# EAGLE design IGauge+V.2.3 (EAGLE 7.5.0)
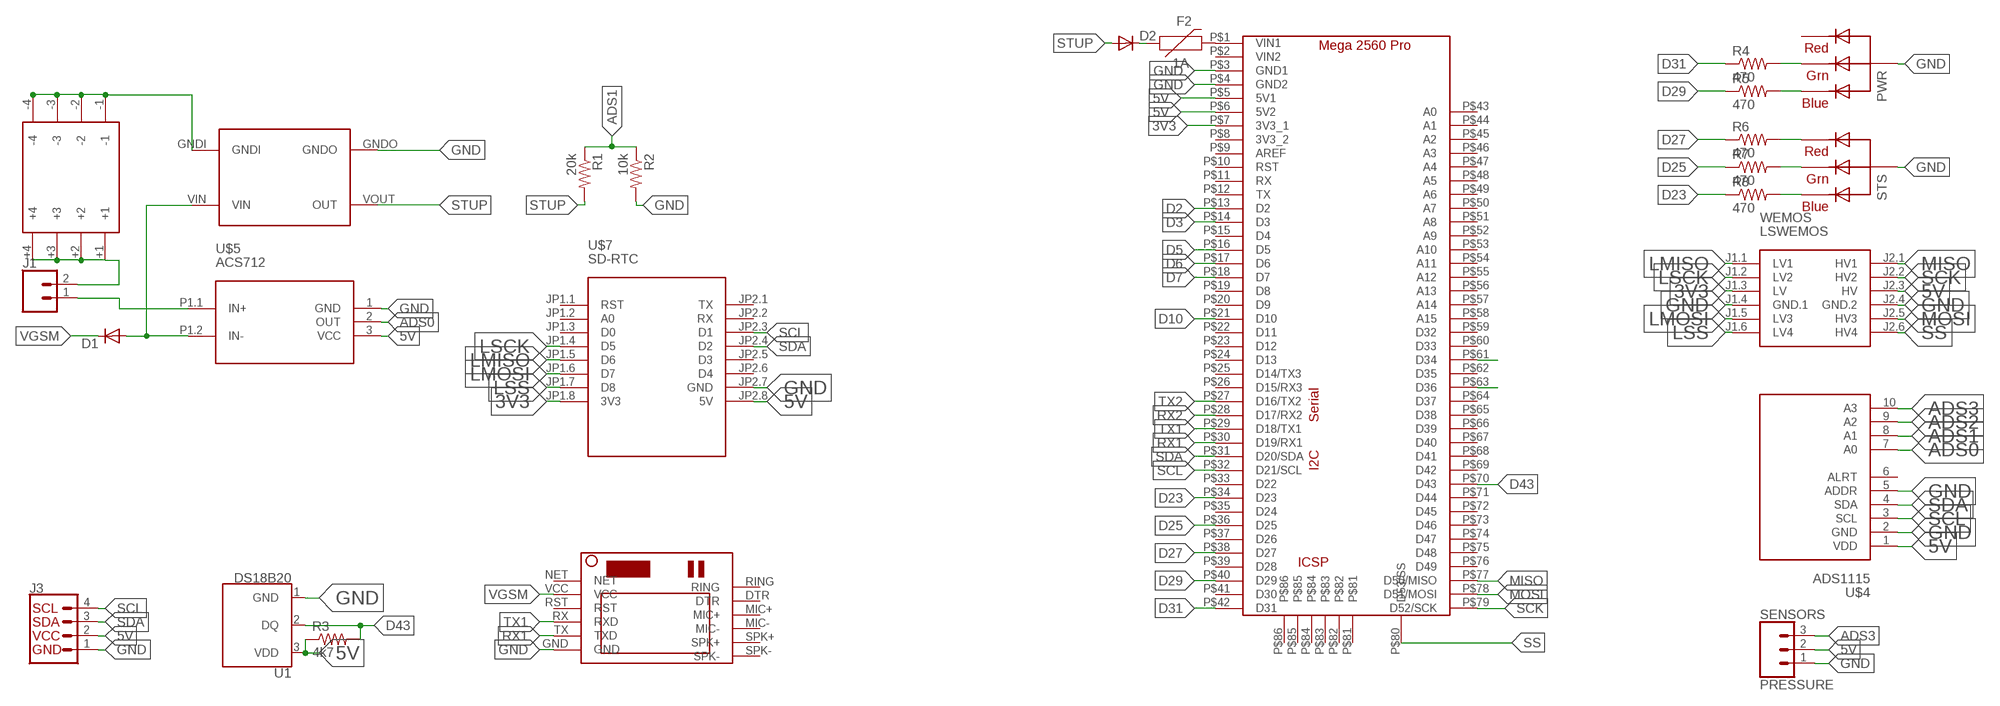
[diagram p0: schematic, sheet 1]

## Parts
D1  DIODE-SOD106A-R  [SOD106A-R]
D2  DIODE-SOD106A-R  [SOD106A-R]
F2  1A  PPTC_HALF-AMP  [1206]
J1  CONN_02  [1X02]
J3  I2C_STANDARD  [1X04]
PWR  RGBLED_CA-5MM  [LED5MMRGB]
R1  20k  R-US_R1206  [R1206]
R2  10k  R-US_R1206  [R1206]
R3  4k7  R-US_M1406  [M1406]
R4  470  R-US_R1206  [R1206]
R5  470  R-US_R1206  [R1206]
R6  470  R-US_R1206  [R1206]
R7  470  R-US_R1206  [R1206]
R8  470  R-US_R1206  [R1206]
SENSORS  PRESSURE  CONN_03POLAR  [MOLEX-1X3]
STS  RGBLED_CA-5MM  [LED5MMRGB]
U1  DS18B20  [TO-92-AMMO]
U$2  MT360_STEPUP  [MT360_STEPUP]
U$3  MEGAPROMINI  [MEGAPROMINI]
U$4  ADS1115  ADC-4CH-ADS1115  [ADC-4CH-ADS1115]
U$5  ACS712  CURRENT-SENSOR-ACS712#IC  [CURRENT-SENSOR-ACS712#IC]
U$7  SD-RTC  WEMOS-D1-MINI-SHIELD  [WEMOS-D1-MINI-SHIELD]
U$9  18650_4PCS_BATTERY_HOLDER  [18650_4PCS_BATTERY_HOLDER]
U$10  SIM800LMODULE  [SIM800LMODULE]
WEMOS  LSWEMOS  LEVEL-SHIFTER-4CH  [LEVEL-SHIFTER-4CH]

## Nets
3V3: U$3.P$7(3V3_1) U$7.JP1.8(3V3) WEMOS.J1.3(LV)
5V: J3.2 R3.1 SENSORS.2 U1.3(VDD) U$3.P$5(5V1) U$3.P$6(5V2) U$4.1(VDD) U$5.3(VCC) U$7.JP2.8(5V) WEMOS.J2.3(HV)
ADS0: U$4.7(A0) U$5.2(OUT)
ADS1: R1.1 R2.1 U$4.8(A1)
ADS2: U$4.9(A2)
ADS3: SENSORS.3 U$4.10(A3)
D2: U$3.P$13(D2)
D3: U$3.P$14(D3)
D5: U$3.P$16(D5)
D6: U$3.P$17(D6)
D7: U$3.P$18(D7)
D10: U$3.P$21(D10)
D23: R8.1 U$3.P$34(D23)
D25: R7.1 U$3.P$36(D25)
D27: R6.1 U$3.P$38(D27)
D29: R5.1 U$3.P$40(D29)
D31: R4.1 U$3.P$42(D31)
D34: U$3.P$61(D34)
D36: U$3.P$63(D36)
D43: R3.2 U1.2(DQ) U$3.P$70(D43)
GND: J3.1 PWR.2(VCC) R2.2 SENSORS.1 STS.2(VCC) U1.1(GND) U$2.GNDO U$3.P$3(GND1) U$3.P$4(GND2) U$4.2(GND) U$4.5(ADDR) U$5.1(GND) U$7.JP2.7(GND) U$10.GND WEMOS.J1.4(GND.1) WEMOS.J2.4(GND.2)
LMISO: U$7.JP1.5(D6) WEMOS.J1.1(LV1)
LMOSI: U$7.JP1.6(D7) WEMOS.J1.5(LV3)
LSCK: U$7.JP1.4(D5) WEMOS.J1.2(LV2)
LSS: U$7.JP1.7(D8) WEMOS.J1.6(LV4)
MISO: U$3.P$77(D50/MISO) WEMOS.J2.1(HV1)
MOSI: U$3.P$78(D51/MOSI) WEMOS.J2.5(HV3)
N$3: J1.1 U$5.P1.1(IN+)
N$4: PWR.3(GREEN) R4.2
N$5: F2.2 U$3.P$1(VIN1)
N$6: D2.C F2.1
N$7: U$2.GNDI U$9.-1 U$9.-4
N$9: U$9.-2
N$12: PWR.4(BLUE) R5.2
N$13: R6.2 STS.1(RED)
N$14: U$9.-3
N$19: R7.2 STS.3(GREEN)
N$20: R8.2 STS.4(BLUE)
RX1: U$3.P$30(D19/RX1) U$10.TX(TXD)
RX2: U$3.P$28(D17/RX2)
SCK: U$3.P$79(D52/SCK) WEMOS.J2.2(HV2)
SCL: J3.4 U$3.P$32(D21/SCL) U$4.3(SCL) U$7.JP2.3(D1)
SDA: J3.3 U$3.P$31(D20/SDA) U$4.4(SDA) U$7.JP2.4(D2)
SS: U$3.P$80(D53/SS) WEMOS.J2.6(HV4)
STUP: D2.A R1.2 U$2.VOUT(OUT)
TX1: U$3.P$29(D18/TX1) U$10.RX(RXD)
TX2: U$3.P$27(D16/TX2)
VACS: D1.A U$2.VIN U$5.P1.2(IN-)
VGSM: D1.C U$10.VCC
VIN: J1.2 U$9.+1 U$9.+2 U$9.+3 U$9.+4
Unconnected: PWR.1(RED) U$3.P$2(VIN2) U$3.P$8(3V3_2) U$3.P$9(AREF) U$3.P$10(RST) U$3.P$11(RX) U$3.P$12(TX) U$3.P$15(D4) U$3.P$19(D8) U$3.P$20(D9) U$3.P$22(D11) U$3.P$23(D12) U$3.P$24(D13) U$3.P$25(D14/TX3) U$3.P$26(D15/RX3) U$3.P$33(D22) U$3.P$35(D24) U$3.P$37(D26) U$3.P$39(D28) U$3.P$41(D30) U$3.P$43(A0) U$3.P$44(A1) U$3.P$45(A2) U$3.P$46(A3) U$3.P$47(A4) U$3.P$48(A5) U$3.P$49(A6) U$3.P$50(A7) U$3.P$51(A8) U$3.P$52(A9) U$3.P$53(A10) U$3.P$54(A11) U$3.P$55(A12) U$3.P$56(A13) U$3.P$57(A14) U$3.P$58(A15) U$3.P$59(D32) U$3.P$60(D33) U$3.P$62(D35) U$3.P$64(D37) U$3.P$65(D38) U$3.P$66(D39) U$3.P$67(D40) U$3.P$68(D41) U$3.P$69(D42) U$3.P$71(D44) U$3.P$72(D45) U$3.P$73(D46) U$3.P$74(D47) U$3.P$75(D48) U$3.P$76(D49) U$3.P$81 U$3.P$82 U$3.P$83 U$3.P$84 U$3.P$85 U$3.P$86 U$4.6(ALRT) U$7.JP1.1(RST) U$7.JP1.2(A0) U$7.JP1.3(D0) U$7.JP2.1(TX) U$7.JP2.2(RX) U$7.JP2.5(D3) U$7.JP2.6(D4) U$10.DTR U$10.MIC+ U$10.MIC- U$10.NET U$10.RING U$10.RST U$10.SPK+ U$10.SPK-

## Library data of the parts
D1 D2 = diode:DIODE-: DIODE
F2 = SparkFun-Fuses:PPTC: Resettable Fuse PPTC Resettable Fuse. Really a sort of resistor with a polymeric positive temperature coefficient whose resistance increases dramatically with an increase in temperature. When heated by the power passing through the resistance rises causing the current to be limited, protecting the circuit. This is achieved by the transition of the polymer from a crystalline to an amorphous state where the conductive carbon separates breaking the conductive pathways found in the cool crystalline structure. When a PPTC cools back down it resumes conducting letting the circuit turn back on. SparkFun Products: SparkFun RedBoard - Programmed with Arduino <https://www.sparkfun.com/products/12757> Pro Micro - 5V/16MHz <https://www.sparkfun.com/products/12640> Arduino Pro 328 - 5V/16MHz <https://www.sparkfun.com/products/10915> MP3 Trigger <https://www.sparkfun.com/products/13720>; PROD_ID: RES-08585; VALUE: 6V/0.5A
J1 = SparkFun-Connectors:CONN_02: Multi connection point. Often used as Generic Header-pin footprint for 0.1 inch spaced/style header connections On any of the 0.1 inch spaced packages, you can populate with these: Break Away Headers - Straight <https://www.sparkfun.com/products/116> (PRT-00116) Break Away Male Headers - Right Angle <https://www.sparkfun.com/products/553> (PRT-00553) Female Headers <https://www.sparkfun.com/products/115> (PRT-00115) Break Away Headers - Machine Pin <https://www.sparkfun.com/products/117> (PRT-00117) Break Away Female Headers - Swiss Machine Pin <https://www.sparkfun.com/products/743> (PRT-00743) For SCREWTERMINALS and SPRING TERMINALS visit here: Screw Terimnals on SparkFun.com <https://www.sparkfun.com/search/results?term=Screw+Terminals> (5mm/3.5mm/2.54mm spacing) This device is also useful as a general connection point to wire up your design to another part of your project. Our various solder wires solder well into these plated through hole pads. Hook-Up Wire - Assortment (Stranded, 22 AWG) <https://www.sparkfun.com/products/11375> (PRT-11375) Hook-Up Wire - Assortment (Solid Core, 22 AWG) <https://www.sparkfun.com/products/11367> (PRT-11367) View the entire wire category on our website here <https://www.sparkfun.com/categories/141> Special notes: Molex polarized connector foot print use with: PRT-08233 with associated crimp pins and housings. 2.54_SCREWTERM for use with PRT-10571. 3.5mm Screw Terminal footprints for PRT-08084 5mm Screw Terminal footprints for use with PRT-08432
J3 = SparkFun-Connectors:I2C_STANDARD: SparkFun I2C Standard Pinout Header SparkFun has standardized on a pinout for all I2C based sensor breakouts. This pinout allows I2C boards to be plugged directly into the headers on Arduino Uno compatible boards, and to be daisy chained easily. Example SparkFun Products: SparkFun Atmospheric Sensor Breakout - BME280 <https://www.sparkfun.com/products/13676> SparkFun Altitude/Pressure Sensor Breakout - MPL3115A2 <https://www.sparkfun.com/products/11084> SparkFun TOF Range Finder Sensor - VL6180 <https://www.sparkfun.com/products/12785>
PWR STS = adafruit:RGBLED_CA: RGB LED, common-anode 5MM Staggered pins 5mm Piranha package http://www.ladyada.net/library/pcb/eaglelibrary.html
R1 R2 R4-R8 = resistor:R-US_: RESISTOR, American symbol
R3 = adafruit:R-US_: RESISTOR, American symbol
SENSORS = SparkFun-Connectors:CONN_03: Multi connection point. Often used as Generic Header-pin footprint for 0.1 inch spaced/style header connections On any of the 0.1 inch spaced packages, you can populate with these: Break Away Headers - Straight <https://www.sparkfun.com/products/116> (PRT-00116) Break Away Male Headers - Right Angle <https://www.sparkfun.com/products/553> (PRT-00553) Female Headers <https://www.sparkfun.com/products/115> (PRT-00115) Break Away Headers - Machine Pin <https://www.sparkfun.com/products/117> (PRT-00117) Break Away Female Headers - Swiss Machine Pin <https://www.sparkfun.com/products/743> (PRT-00743) Stackable Header - 3 Pin (Female, 0.1") <https://www.sparkfun.com/products/13875> (PRT-13875) For SCREWTERMINALS and SPRING TERMINALS visit here: Screw Terimnals on SparkFun.com <https://www.sparkfun.com/search/results?term=Screw+Terminals> (5mm/3.5mm/2.54mm spacing) This device is also useful as a general connection point to wire up your design to another part of your project. Our various solder wires solder well into these plated through hole pads. Hook-Up Wire - Assortment (Stranded, 22 AWG) <https://www.sparkfun.com/products/11375> (PRT-11375) Hook-Up Wire - Assortment (Solid Core, 22 AWG) <https://www.sparkfun.com/products/11367> (PRT-11367) View the entire wire category on our website here <https://www.sparkfun.com/categories/141> Special notes: Molex polarized connector foot print use with SKU : PRT-08232 with associated crimp pins and housings.; PROD_ID: CONN-08625; SF_ID: PRT-08096
U1 = SparkFun-Sensors:DS18B20: Dallas/Maxim DS18B20 1-Wire Temperature Sensor The DS18B20 reports degrees C with 9 to 12-bit precision, -55C to 125C (+/-0.5C). Each sensor has a unique 64-Bit Serial number etched into it - allows for a huge number of sensors to be used on one data bus. Datasheet <http://datasheets.maximintegrated.com/en/ds/DS18B20.pdf> SparkFun Products One Wire Digital Temperature Sensor - DS18B20 <https://www.sparkfun.com/products/245> (SEN-00245); STORE_ID: SEN-00245
U$2 = MT360_STEPUP:MT360_STEPUP
U$3 = MEGAPROMINI:MEGAPROMINI
U$4 = diy-modules:ADC-4CH-ADS1115: 4 Channel 16-Bit Analog-to-Digital Converter based on ADS1115 chip Arduino ADS1115 Getting Started Tutorial is available here: http://henrysbench.capnfatz.com/henrys-bench/arduino-voltage-measurements/arduino-ads1115-module-getting-started-tutorial/ ADS1115 datasheet is available here: http://www.ti.com/lit/ds/symlink/ads1115.pdf Click here to find device on ebay.com <http://www.ebay.com/sch/ads1115+module>
U$5 = diy-modules:CURRENT-SENSOR-ACS712#IC: Isolated Bipolar Current Sensors based on ACS712 chip Symbol with input pins More details available here: http://embedded-lab.com/blog/a-brief-overview-of-allegro-acs712-current-sensor-part-1/ Click here to find device on ebay.com <http://www.ebay.com/sch/acs712+module> Note: There are many available versions with different pinout. Please check before use
U$7 = diy-modules:WEMOS-D1-MINI-SHIELD: Template for WEMOS D1 mini compatible shields NOTICE: This is a template only. You can use it as a base to create symbols for WEMOS D1 mini compatible shields. Official list of available shields can be found here: https://www.wemos.cc/D1-mini-Shields
U$9 = 18650-Battery-Holder:18650_4PCS_BATTERY_HOLDER
U$10 = SIM800LMODULE:SIM800LMODULE: SIM800L Module
WEMOS = diy-modules:LEVEL-SHIFTER-4CH: 4-Channel Bi-Directional Logic Level Converter based on BSS128 transistors Click here to find device on ebay.com <http://www.ebay.com/sch/i2c+logic+converter+module>

## Board
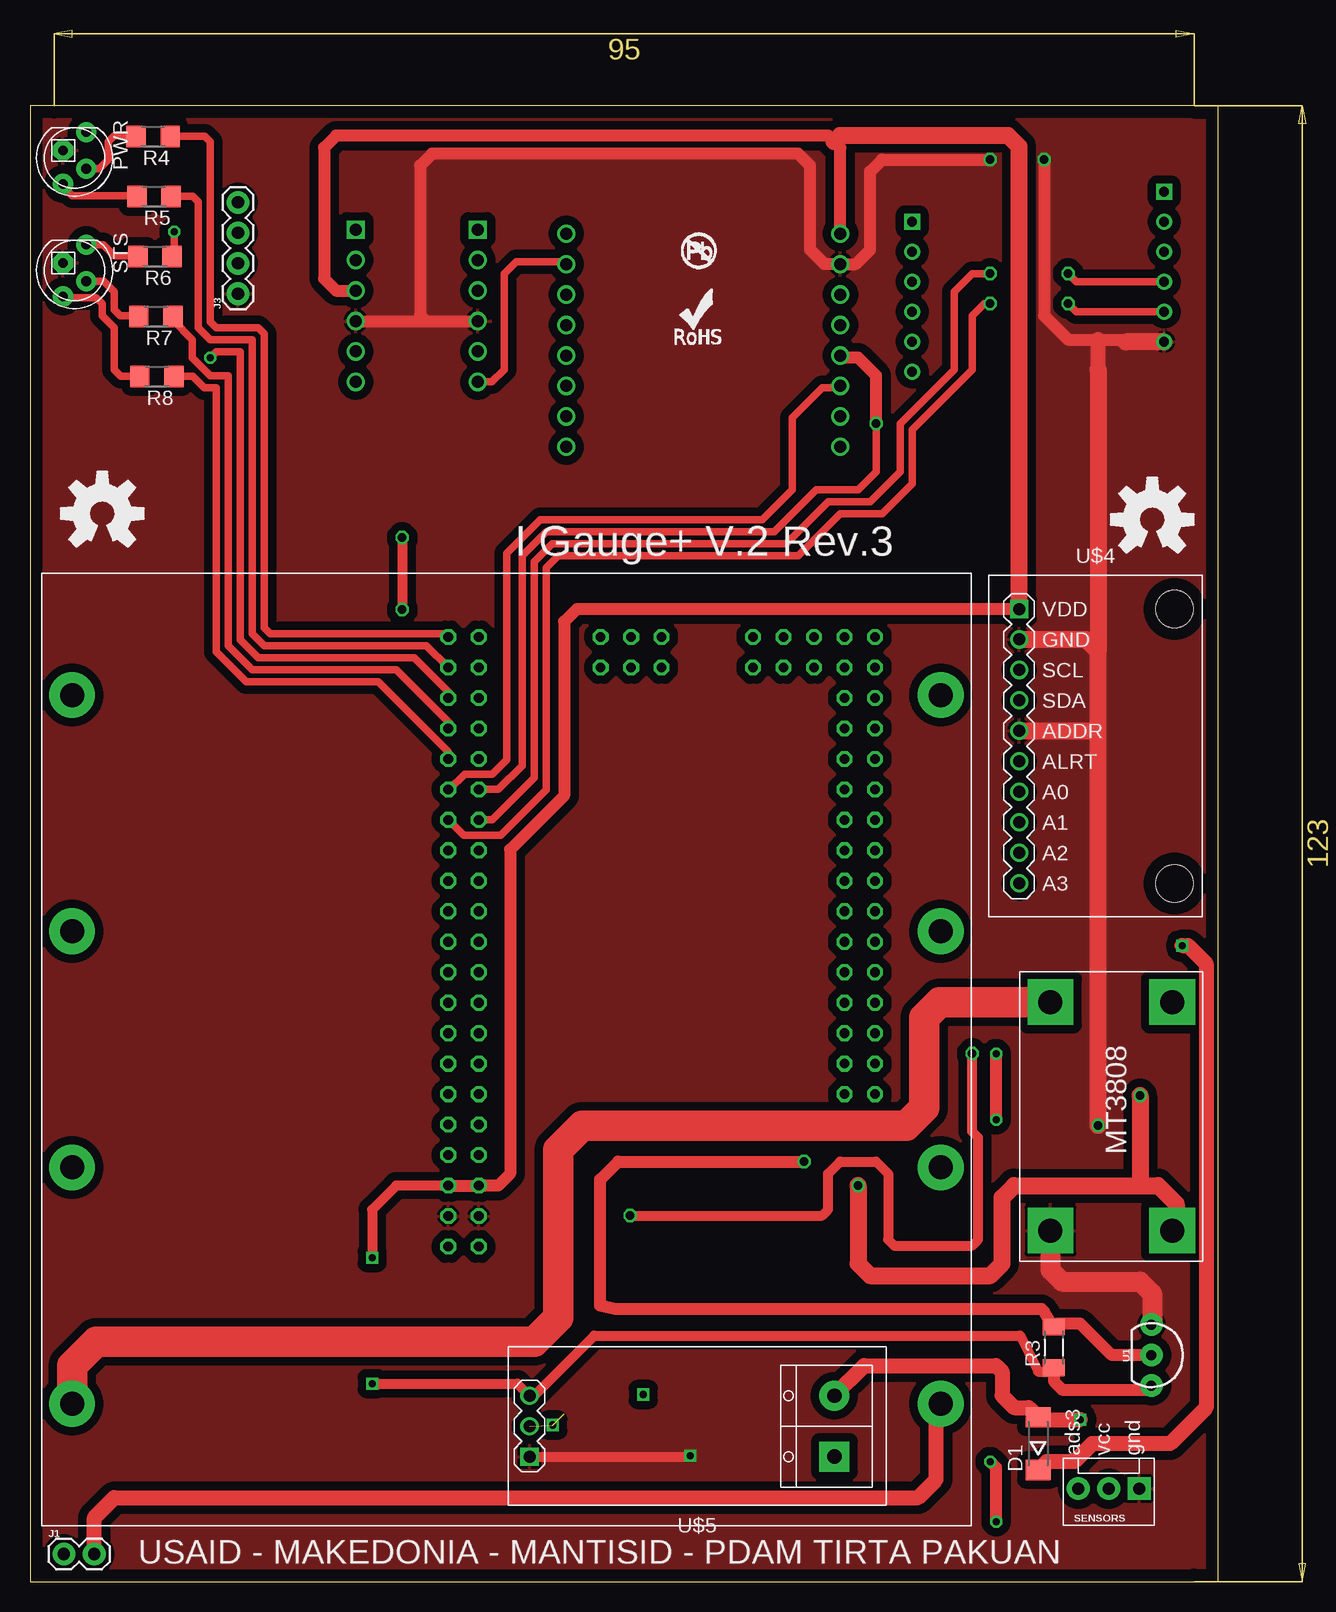
[diagram p1: board, top side]
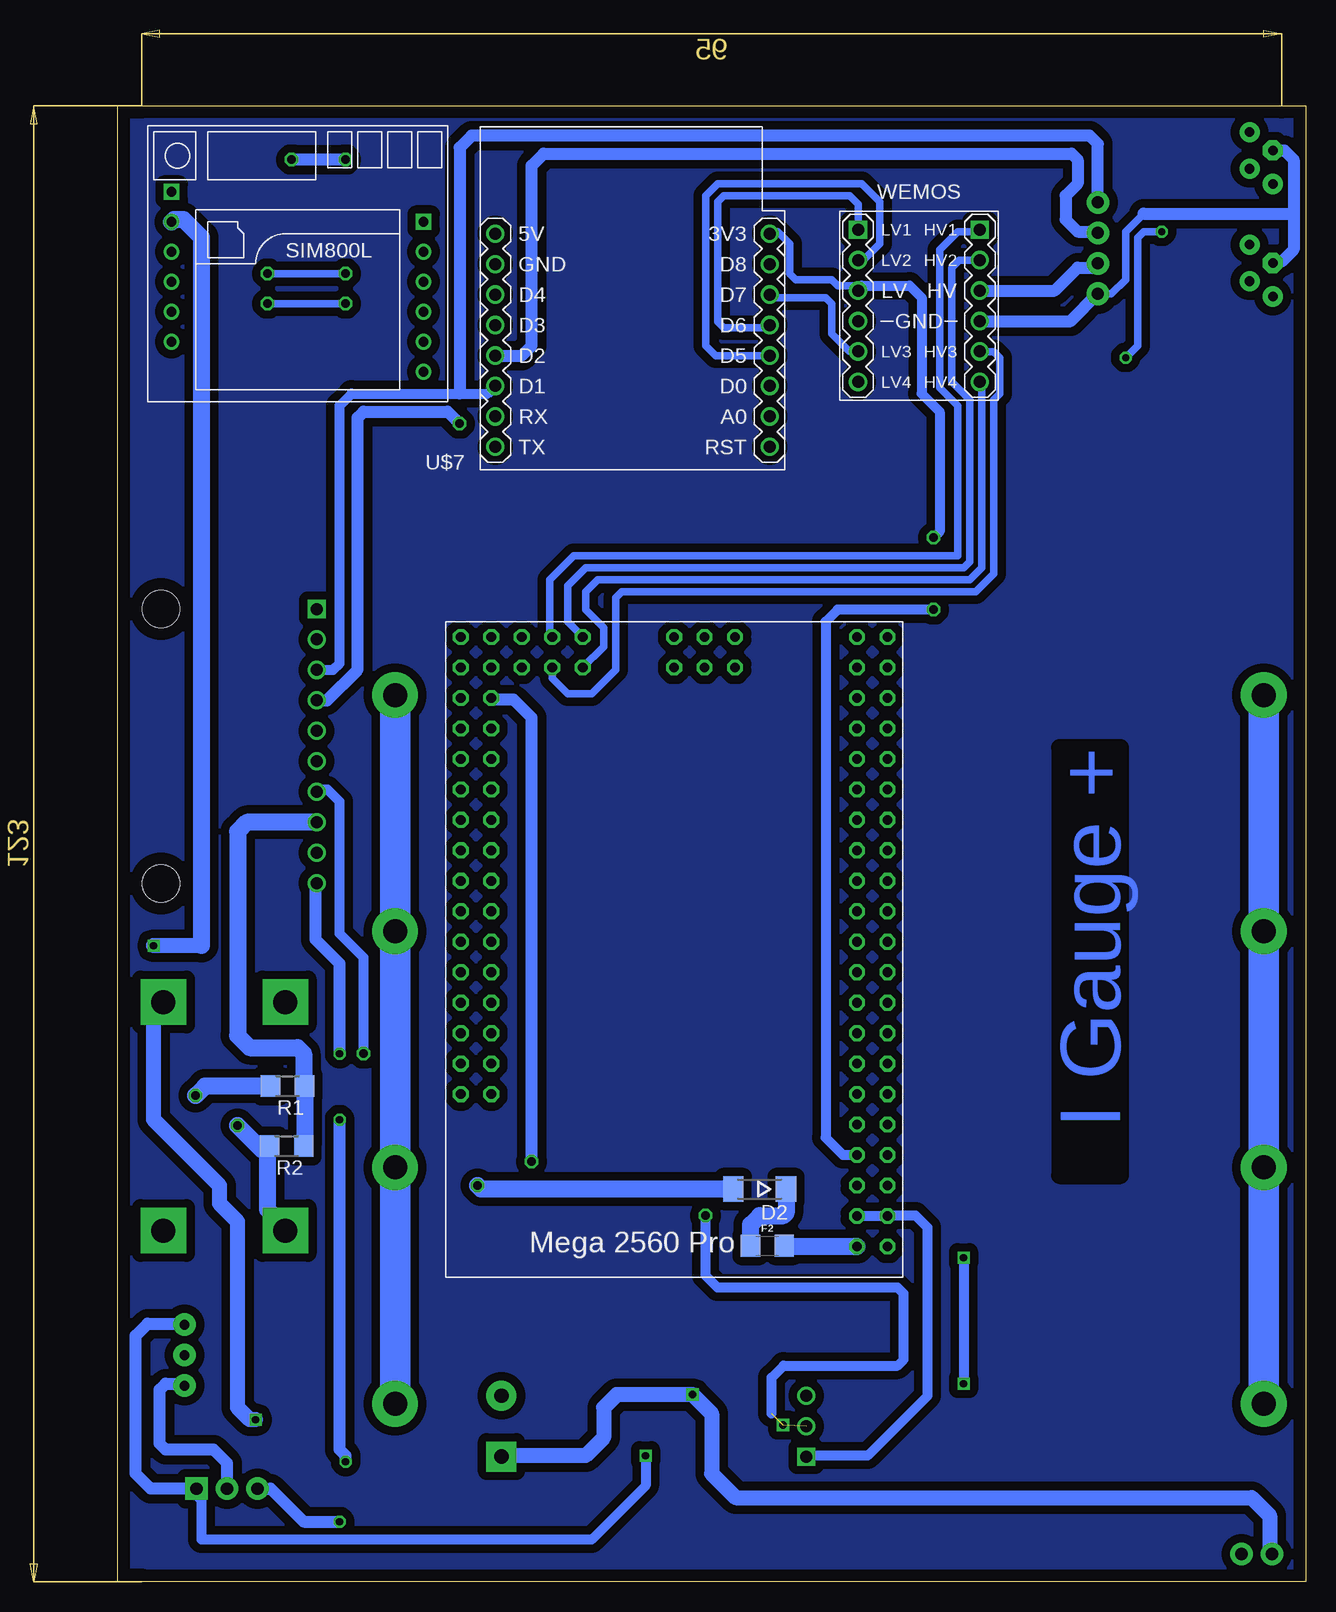
[diagram p2: board, bottom side, seen from below]

Size 99 x 123 mm. Coordinates in mm from the lower left corner, seen from the top.
Outline: 0,123 0,0 99,0 99,123 0,123
Copper layers (1*16): Top 0.035mm / dielectric 1.5mm / Bottom 0.035mm
Design rules "default *": minimum track width 10mil, minimum drill 24mil, track to track 28mil, track to pad 28mil, pad to pad 28mil, via to via 28mil, smd to smd 28mil, copper to edge 40mil, drill to drill 8mil, minimum pad ring 10mil, minimum via ring 8mil, stop-mask expansion 4mil, vias tented up to drill 0mil, thermal gap 10mil

### Footprints (pad centres in the part's own frame; a part is rotated, then mirrored left to right if it is on the bottom)
SOD106A-R = smd 1.7 x 2.1: A 2.2,0; C -2.2,0
1206 = smd 1.6 x 1.8: 1 -1.4,0; 2 1.4,0
1X02 = drill 1.016 pad 1.88: 1 0,0; 2 2.54,0
1X04 = drill 1.016 pad 1.88: 1 0,0; 2 2.54,0; 3 5.08,0; 4 7.62,0
LED5MMRGB = drill 0.8 pad 1.676: 1 -2.159,0.968; 3 0.889,0.968; 4 2.159,-0.968 | drill 0.8 pad 1.676 octagon: 2 -0.635,-0.968
R1206 = smd 1.6 x 1.803: 1 -1.422,0; 2 1.422,0
M1406 = smd 1.4 x 1.8: 1 -1.7,0; 2 1.7,0
MOLEX-1X3 = drill 1.016 pad 1.88 square: 1 0,0 | drill 1.016 pad 1.88: 2 2.54,0; 3 5.08,0
TO-92-AMMO = drill 0.813 pad 1.88: 1 -2.54,0; 2 0,0; 3 2.54,0
MT360_STEPUP = drill 2 pad 3.81 square: GNDI 3.81,-2.54; GNDO 3.81,-21.59; VIN 13.97,-2.54; VOUT 13.97,-21.59
MEGAPROMINI = drill 0.8 octagon: P$1 3.81,-2.54; P$2 1.27,-2.54; P$3 3.81,-5.08; P$4 1.27,-5.08; P$5 3.81,-7.62; P$6 1.27,-7.62; P$7 3.81,-10.16; P$8 1.27,-10.16; P$9 3.81,-12.7; P$10 1.27,-12.7; P$11 3.81,-15.24; P$12 1.27,-15.24; P$13 3.81,-17.78; P$14 1.27,-17.78; P$15 3.81,-20.32; P$16 1.27,-20.32; P$17 3.81,-22.86; P$18 1.27,-22.86; P$19 3.81,-25.4; P$20 1.27,-25.4; P$21 3.81,-27.94; P$22 1.27,-27.94; P$23 3.81,-30.48; P$24 1.27,-30.48; P$25 3.81,-33.02; P$26 1.27,-33.02; P$27 3.81,-35.56; P$28 1.27,-35.56; P$29 3.81,-38.1; P$30 1.27,-38.1; P$31 3.81,-40.64; P$32 1.27,-40.64; P$33 3.81,-43.18; P$34 1.27,-43.18; P$35 3.81,-45.72; P$36 1.27,-45.72; P$37 3.81,-48.26; P$38 1.27,-48.26; P$39 3.81,-50.8; P$40 1.27,-50.8; P$41 3.81,-53.34; P$42 1.27,-53.34; P$43 36.83,-15.24; P$44 34.29,-15.24; P$45 36.83,-17.78; P$46 34.29,-17.78; P$47 36.83,-20.32; P$48 34.29,-20.32; P$49 36.83,-22.86; P$50 34.29,-22.86; P$51 36.83,-25.4; P$52 34.29,-25.4; P$53 36.83,-27.94; P$54 34.29,-27.94; P$55 36.83,-30.48; P$56 34.29,-30.48; P$57 36.83,-33.02; P$58 34.29,-33.02; P$59 36.83,-35.56; P$60 34.29,-35.56; P$61 36.83,-38.1; P$62 34.29,-38.1; P$63 36.83,-40.64; P$64 34.29,-40.64; P$65 36.83,-43.18; P$66 34.29,-43.18; P$67 36.83,-45.72; P$68 34.29,-45.72; P$69 36.83,-48.26; P$70 34.29,-48.26; P$71 36.83,-50.8; P$72 34.29,-50.8; P$73 36.83,-53.34; P$74 34.29,-53.34; P$75 31.75,-53.34; P$76 31.75,-50.8; P$77 29.21,-53.34; P$78 29.21,-50.8; P$79 26.67,-53.34; P$80 26.67,-50.8; P$81 19.05,-53.34; P$82 19.05,-50.8; P$83 16.51,-53.34; P$84 16.51,-50.8; P$85 13.97,-53.34; P$86 13.97,-50.8
ADC-4CH-ADS1115 = drill 1 square: 1 -6.35,11.43 | drill 1: 2 -6.35,8.89; 3 -6.35,6.35; 4 -6.35,3.81; 5 -6.35,1.27; 6 -6.35,-1.27; 7 -6.35,-3.81; 8 -6.35,-6.35; 9 -6.35,-8.89; 10 -6.35,-11.43 | hole 3.1: 6.604,11.43; 6.604,-11.43
CURRENT-SENSOR-ACS712#IC = drill 1 square: 1 13.97,2.54 | drill 1: 2 13.97,0; 3 13.97,-2.54 | drill 1.2 pad 2.5 square: P1.1 -11.43,2.54 | drill 1.2 pad 2.5: P1.2 -11.43,-2.54
WEMOS-D1-MINI-SHIELD = drill 1: JP1.1 -11.43,12.065; JP1.2 -11.43,9.525; JP1.3 -11.43,6.985; JP1.4 -11.43,4.445; JP1.5 -11.43,1.905; JP1.6 -11.43,-0.635; JP1.7 -11.43,-3.175; JP1.8 -11.43,-5.715; JP2.1 11.43,12.065; JP2.2 11.43,9.525; JP2.3 11.43,6.985; JP2.4 11.43,4.445; JP2.5 11.43,1.905; JP2.6 11.43,-0.635; JP2.7 11.43,-3.175; JP2.8 11.43,-5.715
18650_4PCS_BATTERY_HOLDER = drill 2 pad 3.81: +1 10.16,74.93; +2 29.845,74.93; +3 49.53,74.93; +4 69.215,74.93; -1 10.16,2.54; -2 29.845,2.54; -3 49.53,2.54; -4 69.215,2.54
SIM800LMODULE = drill 0.8: DTR 10.5,1; GND -10.5,-6.5; MIC+ 10.5,-1.5; MIC- 10.5,-4; RST -10.5,1; RX -10.5,-1.5; SPK+ 10.5,-6.5; SPK- 10.5,-9; TX -10.5,-4; VCC -10.5,3.5 | drill 0.8 square: NET -10.5,6; RING 10.5,3.5
LEVEL-SHIFTER-4CH = drill 1 square: J1.1 -5.08,6.35; J2.1 5.08,6.35 | drill 1: J1.2 -5.08,3.81; J1.3 -5.08,1.27; J1.4 -5.08,-1.27; J1.5 -5.08,-3.81; J1.6 -5.08,-6.35; J2.2 5.08,3.81; J2.3 5.08,1.27; J2.4 5.08,-1.27; J2.5 5.08,-3.81; J2.6 5.08,-6.35

### Placement (x,y rotation side)
D1  84,11.5 90 top
D2  45.5,32.71 180 bottom
F2  44.85,27.99 0 bottom
J1  2.8,2.3 0 top
J3  17.31,107.32 90 top
PWR  3.7,118.63 270 top
R1  84.84,41.3 180 bottom
R2  84.92,36.3 180 bottom
R3  85.3,19.51 90 top
R4  10.24,120.44 180 top
R5  10.32,115.44 180 top
R6  10.4,110.44 180 top
R7  10.48,105.44 180 top
R8  10.56,100.44 180 top
SENSORS  92.42,7.74 180 top
STS  3.7,109.25 270 top
U1  93.43,18.87 270 top
U$1  [NO_PB_LOGO_0.120]  54,109 0 top
U$2  81.21,50.84 0 top
U$3  33.57,25.38 180 bottom
U$4  88.77,69.62 0 top
U$5  55.58,12.95 180 top
U$6  [OSHW-LOGO-L]  6,89 0 top
U$7  56.09,106.62 180 bottom
U$8  [OSHW-LOGO-L]  93.5,88.5 0 top
U$9  0.95,84.04 270 top
U$10  84,109.82 0 bottom
U$11  [ROHS_LOGO_0.18_IN]  53.5,103 0 top
WEMOS  32.22,106.32 0 bottom

### Tracks (layer width: path | path; a pad name or v marks a point on that pad's centre or on a via)
3V3  (via drill 0.7)
  Top 0.813: v31,87 v31,81
  Bottom 0.61: WEMOS.J1.3 37.71,108 39,108 39.5,108.5 42.5,108.5 43,109 43,111.5 44,112.5 44.49,112.5 U$7.JP1.8
  Bottom 0.813: U$3.P$7 38.54,35.54 39,36 39.5,36.5 40,37 40,80 39,81 v31,81 | WEMOS.J1.3 37.3,107.7 37,108 33,108 32,107 32,99 30.5,97.5 30.5,87.5 v31,87
5V  (via drill 0.6)
  Top 0.813: 39,33 30.5,33 28.5,31 v28.5,27 | v28.5,16.5 40.6,16.5 U$5.3 41.99,15.49 47,20.5 82.5,20.5 84,17.5 84.99,17.5 R3.1
  Top 1.016: U$7.JP2.8 67.52,119.48 67,120 66.5,120.5 25.5,120.5 24.5,119.5 24.5,108.59 25.5,107.59 WEMOS.J2.3 | R3.1 85.3,16.7 86,16 93.1,16 U1.3 | U$3.P$6 U$3.P$5 39,33 40,34 40,61 44.5,65.5 44.5,80 45.55,81.05 U$4.1
  Top 1.422: U$4.1 82.42,119.58 81.5,120.5 67.5,120.5 67,120
  Bottom 0.813: v28.5,27 v28.5,16.5
  Bottom 1.016: WEMOS.J2.3 20.91,107.59 19,109.5 17.67,109.5 J3.2 | SENSORS.2 89.88,9.88 91,11 95,11 95.5,11.5 95.5,16 95,16.5 93.6,16.5 U1.3
ADS0  (via drill 0.6, 0.7)  (2 unrouted)
  Top 0.813: v50,30.5 66,30.5 66.5,31 66.5,34 67.5,35 70.5,35 71.5,34 71.5,28.5 72,28 78.5,28 79,28.5 79,37 78.5,37.5 v78.5,44
  Bottom 0.813: 44.5,14 44.5,17 43.5,18 34,18 33.5,18.5 33.5,24 34,24.5 49,24.5 50,25.5 v50,30.5 | v78.5,44 78.5,52 80.5,54 80.5,65 81.5,66 82.23,66 U$4.7
  other vias: 43.55,13.05
ADS1
  Bottom 1.422: U$4.8 88.23,63.27 89,62.5 89,45.5 88,44.5 84,44.5 83.5,44 83.5,41.38 R1.1 83.42,36.38 R2.1
ADS3  (via drill 0.6)
  Top 1.016: v80.5,5 80.5,9.5 v80,10 | v80.5,38.5 v80.5,44
  Bottom 1.016: SENSORS.3 86.24,7.74 83.5,5 v80.5,5 | v80,10 80,10.5 80.5,11 v80.5,38.5 | v80.5,44 80.5,51.5 82.5,53.5 82.5,58.11 U$4.10
D23
  Top 0.61: R8.1 13.56,100.44 14.5,99.5 15.5,99.5 15.5,77.5 18,75 29,75 34.84,69.16 U$3.P$34
D25
  Top 0.61: R7.1 11.9,105.1 13.5,103.5 13.5,102 15,100.5 16.5,100.5 16.5,78 18.5,76 30.5,76 35,71.5 35,71.26 U$3.P$36
D27  (via drill 0.6)
  Top 0.61: v15,102 15.5,102.5 17.5,102.5 17.5,78.5 19,77 32,77 35,74 35,73.8 U$3.P$38 | v12,112.5 12,110.62 R6.1
  Bottom 0.61: v15,102 14,103 14,112 13.5,112.5 v12,112.5
D29
  Top 0.61: R5.1 13.56,115.44 14,115 14,104.5 15,103.5 18.5,103.5 18.5,79 19.5,78 33.02,78 U$3.P$40
D31
  Top 0.61: R4.1 14.56,120.44 15,120 15,105 15.5,104.5 19,104.5 19.5,104 19.5,79.5 20,79 34.56,79 U$3.P$42
D43  (via drill 0.7)
  Top 1.016: U1.2 90.13,18.87 87.5,21.5 85.59,21.5 R3.2 84.5,22.5 84.29,22.71 48.79,22.71 47.5,23 47.5,33.5 49,35 v64.5,35
  Bottom 1.016: v64.5,35 64.5,72 66,73.5 67.72,73.5 U$3.P$70
GND  (via drill 0.6, 0.7)
  Top 0.61: 27.09,105 WEMOS.J2.4
  Top 0.813: U$5.1 54.91,10.41 v55,10.5
  Top 1.016: WEMOS.J2.4 33,105.05 | 33,105.05 WEMOS.J1.4 | 33,105.05 32.5,105.55 32.5,118 33.5,119 64,119 65,118 65,111 66.2,109.79 U$7.JP2.7 68.8,109.79 70,111 70,117.5 71,118.5 v80,118.5 | v84.5,118.5 84.5,105.5 86.5,103.5 89,103.5 93.82,103.5 94,103.32
  Top 1.27: 89,101 89,103.5
  Top 1.422: v89,38 89,71 | 89,71 89,77.5 | 89,77.5 88,78.5 U$4.2 | U$4.5 88.89,70.89 89,71 | U$10.GND 94,103.32 91.32,103.32 | 89,101 89,77.5
  Top 1.676: U$2.GNDO 85.02,25.98 86,25 92.5,25 93.5,24 93.5,21.48 U1.1
  Bottom 0.61: J3.1 16.18,107.32 15,108.5 15,112.5 13.5,114
  Bottom 0.813: U$3.P$3 U$3.P$4 34.8,30.5 32.5,30.5 31.5,29.5 31.5,15.5 36.5,10.5 41.52,10.5 U$5.1 | v55,10.5 55,8 59.5,3.5 92,3.5 92,6.74 93,7.74
  Bottom 1.016: WEMOS.J2.4 19.58,105.05 J3.1 | 13.5,114 1,114 | PWR.2 1.77,119.26 1,118.5 1,114 | STS.2 2.62,110 2,110 1,111 1,114 | SENSORS.1 93,7.74 96.24,7.74 97.5,9 97.5,20.5 96.5,21.5 93.52,21.5 U1.1 | v80,118.5 v84.5,118.5
  Bottom 1.422: U$2.GNDO 85.02,29.52 86.5,31 86.5,36 | 86.5,36 86.5,36.14 R2.2 86.34,36.16 86.5,36 | 86.5,36 87,36 v89,38
  pour Top: 0,123 99,123 99,0 0,0
LMISO
  Bottom 0.61: WEMOS.J1.1 37.3,114.8 38,115.5 48.5,115.5 49,115 49,105 48.5,104.5 44.88,104.5 U$7.JP1.5
LMOSI
  Bottom 0.61: WEMOS.J1.5 38.01,102.51 39.5,104 39.5,106.5 40,107 44.41,107 U$7.JP1.6
LSCK
  Bottom 0.61: U$7.JP1.4 49.17,102.18 50,103 50,115.5 49,116.5 37,116.5 35.5,115 35.5,111.5 37,110 37.17,110 WEMOS.J1.2
LSS
  Top 0.61: WEMOS.J1.6 38.47,99.97 39.5,101 39.5,109 40.5,110 44.45,110 U$7.JP1.7
MISO
  Bottom 0.61: WEMOS.J2.1 27.31,112.5 29,112.5 30.5,111 30.5,99.5 29,98 29,85.5 61,85.5 63,83.5 63,78.94 U$3.P$77
MOSI
  Bottom 0.61: WEMOS.J2.5 26,102.5 25.5,102 25.5,99 26,98.5 26,84 27.5,82.5 57,82.5 57.5,82 57.5,76 59.5,74 61.5,74 62.78,75.28 U$3.P$78
N$3  (via drill 0.6)
  Bottom 1.27: J1.1 3,2.5 3,5.5 4.5,7 47.5,7 49.5,9 49.5,14 v51.09,15.59 57.41,15.59 58.5,14.5 58.5,12 60,10.5 66.92,10.5 U$5.P1.1
N$4
  Top 0.61: PWR.3 5.74,117.74 6.5,118.5 6.5,120 7,120.5 8.76,120.5 R4.2
N$5
  Bottom 1.422: U$3.P$1 43.38,27.92 F2.2
N$6
  Bottom 1.422: F2.1 46.25,29.75 45.5,30.5 43.5,30.5 43.3,30.7 D2.C
N$7
  Top 2.54: U$2.GNDI 75.8,48.3 74.5,47 74.5,39.5 73,38 46,38 44,36 44,22 42,20 5.5,20 3.5,18 3.5,15.5 4,15 3.66,15 U$9.-4
  Bottom 2.54: U$9.-4 3.49,15.49 3.5,15.5 U$9.-1
N$12
  Top 0.61: PWR.4 2.73,116.27 3.5,115.5 8.84,115.5 R5.2
N$13
  Top 0.61: STS.1 6.09,111.41 7,110.5 8.92,110.5 R6.2
N$19
  Top 0.61: STS.3 6.14,108.36 7,107.5 7,106 7.5,105.5 9,105.5 R7.2
N$20
  Top 0.61: R8.2 7.56,100.44 7,101 7,104.5 6,105.5 6,106.5 5.5,107 2.82,107 STS.4
RX1  (via drill 0.7)
  Top 0.61: U$10.TX 87.18,105.82 v86.5,106.5 | v80,106.5 79.5,106.5 78.5,105.5 78.5,101 73.5,96 73.5,91.5 71,89 67.5,89 64,85.5 44,85.5 43,84.5 43,66 39.2,62.2 36.12,62.2 U$3.P$30
  Bottom 0.61: v86.5,106.5 v80,106.5
SCK
  Bottom 0.61: WEMOS.J2.2 28.87,110.13 29.5,109.5 29.5,100 28,98.5 28,85 28.5,84.5 60,84.5 61.5,83 61.5,80 60.24,78.74 U$3.P$79
SCL
  Top 0.61: U$3.P$32 34.92,66.02 36.2,67.3 38.5,67.3 39.7,68.5 39.7,85.7 42.5,88.5 61,88.5 63.5,91 63.5,97 66,99.5 67.39,99.5 U$7.JP2.3
  Bottom 0.813: U$4.3 81.03,75.97 80.5,76.5 80.5,98 79.5,99 70.5,99 68.16,99 U$7.JP2.3
  Bottom 1.016: J3.4 17.31,119.81 18,120.5 69.5,120.5 70.5,119.5 70.5,99 | 67.66,99.5 U$7.JP2.3
SDA  (via drill 0.7)
  Top 0.61: U$3.P$31 39.02,66.02 41,68 41,85.5 43,87.5 62,87.5 65.5,91 69,91 70.5,92.5 v70.5,96.5
  Top 1.016: v70.5,96.5 70.5,100.5 69,102 67.69,102 U$7.JP2.4
  Bottom 1.016: U$7.JP2.4 65.33,102.18 64.5,103 64.5,118 63.5,119 19.5,119 19,118.5 19,116.5 20,115.5 20,113.5 19,112.5 17.41,112.5 J3.3 | U$4.4 81.57,73.43 79,76 79,97 78.5,97.5 71.5,97.5 v70.5,96.5
SS
  Bottom 0.61: WEMOS.J2.6 27,99.83 27,84.5 28,83.5 59,83.5 60,82.5 60,81 58.5,79.5 58.5,77.92 U$3.P$80
STUP  (via drill 0.7)
  Top 1.422: 92.5,33 94,33 95.5,31.5 95.5,29.57 U$2.VOUT | v92.5,40.5 92.5,33 | v69,33 69,26.5 70,25.5 80,25.5 81,26.5 81,32 82,33 92.5,33
  Bottom 1.422: D2.A 68.71,32.71 v69,33 | R1.2 91.7,41.3 v92.5,40.5
TX1  (via drill 0.7)
  Top 0.61: U$10.RX 87.18,108.32 v86.5,109 | v80,109 78.5,109 77,107.5 77,101 72.5,96.5 72.5,92.5 70,90 66.5,90 63,86.5 43.5,86.5 42,85 42,67 38.5,63.5 37.4,63.5 U$3.P$29
  Bottom 0.61: v86.5,109 v80,109
VACS  (via drill 0.6)
  Top 1.27: U$5.P1.2 67.01,15.51 69.5,18 80.5,18 81,17.5 81,15.5 82,14.5 83.2,14.5 D1.A 84.2,13.5 v87.5,13.5
  Bottom 1.27: v87.5,13.5 88,13.5 89,14.5 89,30 90.5,31.5 90.5,33 96,38.5 96,47.48 U$2.VIN
VGSM  (via drill 0.6)
  Top 1.27: v96,53 96.5,53 98,51.5 98,14.5 95,11.5 88.5,11.5 87,10 84.7,10 D1.C
  Bottom 1.27: 92,53 v96,53
  Bottom 1.422: 92,53 92,112 93.5,113.5 94.32,113.5 U$10.VCC
VIN
  Top 1.27: J1.2 5.34,5.34 7,7 74,7 75.5,8.5 75.5,14.45 U$9.+4
  Bottom 2.54: U$9.+1 U$9.+2 75.88,35.12 76.5,34.5 U$9.+3 U$9.+4 75.88,14.88 76,15
W
  pour Bottom: 0,123 99,123 99,0 0,0

### Text on the board
Bottom: I Gauge +
tNames: I Gauge+ V.2 Rev.3 | ads3 | vcc | gnd | USAID - MAKEDONIA - MANTISID - PDAM TIRTA PAKUAN